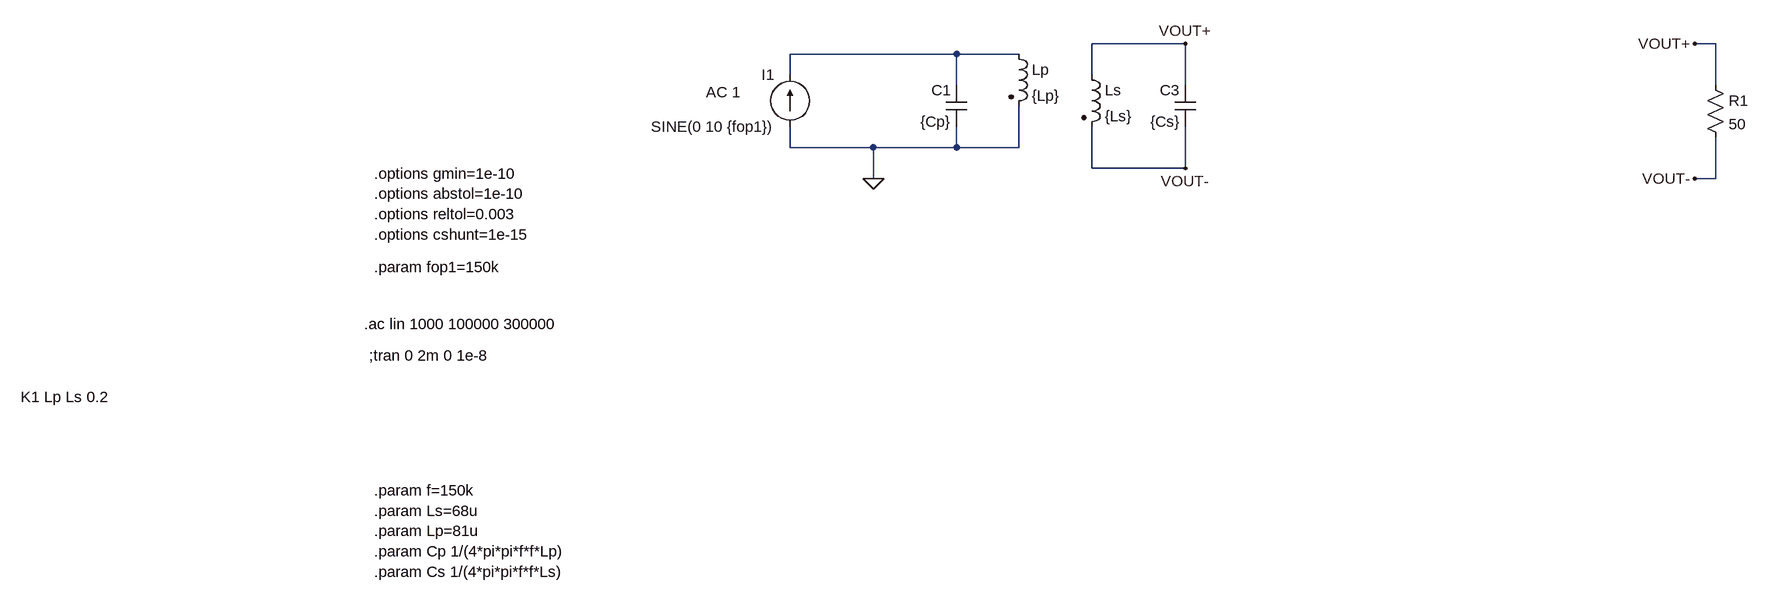
[diagram p0: schematic Parallel.asc]
Parallel.asc, the LTspice schematic file:
Version 4
SHEET 1 2212 680
WIRE 1328 -368 1184 -368
WIRE 2144 -368 2112 -368
WIRE 976 -352 720 -352
WIRE 1072 -352 976 -352
WIRE 720 -320 720 -352
WIRE 1184 -320 1184 -368
WIRE 976 -304 976 -352
WIRE 1328 -304 1328 -368
WIRE 2144 -304 2144 -368
WIRE 720 -208 720 -240
WIRE 848 -208 720 -208
WIRE 976 -208 976 -240
WIRE 976 -208 848 -208
WIRE 1072 -208 1072 -272
WIRE 1072 -208 976 -208
WIRE 1184 -176 1184 -240
WIRE 1328 -176 1328 -240
WIRE 1328 -176 1184 -176
WIRE 848 -160 848 -208
WIRE 2144 -160 2144 -224
WIRE 2144 -160 2112 -160
FLAG 848 -160 0
FLAG 2112 -368 VOUT+
FLAG 2112 -160 VOUT-
FLAG 1328 -368 VOUT+
FLAG 1328 -176 VOUT-
SYMBOL ind2 1056 -368 R0
SYMATTR InstName Lp
SYMATTR Value {Lp}
SYMATTR Type ind
SYMBOL cap 992 -240 R180
WINDOW 0 24 56 Left 2
WINDOW 3 24 8 Left 2
SYMATTR InstName C1
SYMATTR Value {Cp}
SYMBOL ind2 1168 -336 R0
SYMATTR InstName Ls
SYMATTR Value {Ls}
SYMATTR Type ind
SYMBOL cap 1344 -240 R180
WINDOW 0 24 56 Left 2
WINDOW 3 24 8 Left 2
SYMATTR InstName C3
SYMATTR Value {Cs}
SYMBOL res 2128 -320 R0
SYMATTR InstName R1
SYMATTR Value 50
SYMBOL current 720 -240 R180
WINDOW 0 24 80 Left 2
WINDOW 3 24 0 Left 2
WINDOW 123 76 53 Left 2
WINDOW 39 0 0 Left 0
SYMATTR InstName I1
SYMATTR Value SINE(0 10 {fop1})
SYMATTR Value2 AC 1
TEXT 72 112 Left 2 !;tran 0 2m 0 1e-8
TEXT 80 320 Left 2 !.param f=150k  \n.param Ls=68u\n.param Lp=81u\n.param Cp 1/(4*pi*pi*f*f*Lp)\n.param Cs 1/(4*pi*pi*f*f*Ls)
TEXT 64 64 Left 2 !.ac lin 1000 100000 300000
TEXT 80 -24 Left 2 !.param fop1=150k
TEXT 80 -168 Left 2 !.options gmin=1e-10   \n.options abstol=1e-10  \n.options reltol=0.003  \n.options cshunt=1e-15
TEXT -464 176 Left 2 !K1 Lp Ls 0.2

The netlist it stands for:
* Parallel.asc
Lp N001 0 {Lp}
C1 0 N001 {Cp}
Ls VOUT+ VOUT- {Ls}
C3 VOUT- VOUT+ {Cs}
R1 VOUT+ VOUT- 50
I1 0 N001 SINE(0 10 {fop1}) AC 1
;tran 0 2m 0 1e-8
.param f=150k
.param Ls=68u
.param Lp=81u
.param Cp 1/(4*pi*pi*f*f*Lp)
.param Cs 1/(4*pi*pi*f*f*Ls)
.ac lin 1000 100000 300000
.param fop1=150k
.options gmin=1e-10
.options abstol=1e-10
.options reltol=0.003
.options cshunt=1e-15
K1 Lp Ls 0.2
.backanno
.end